# EAGLE design 55percent (EAGLE 9.5.2)
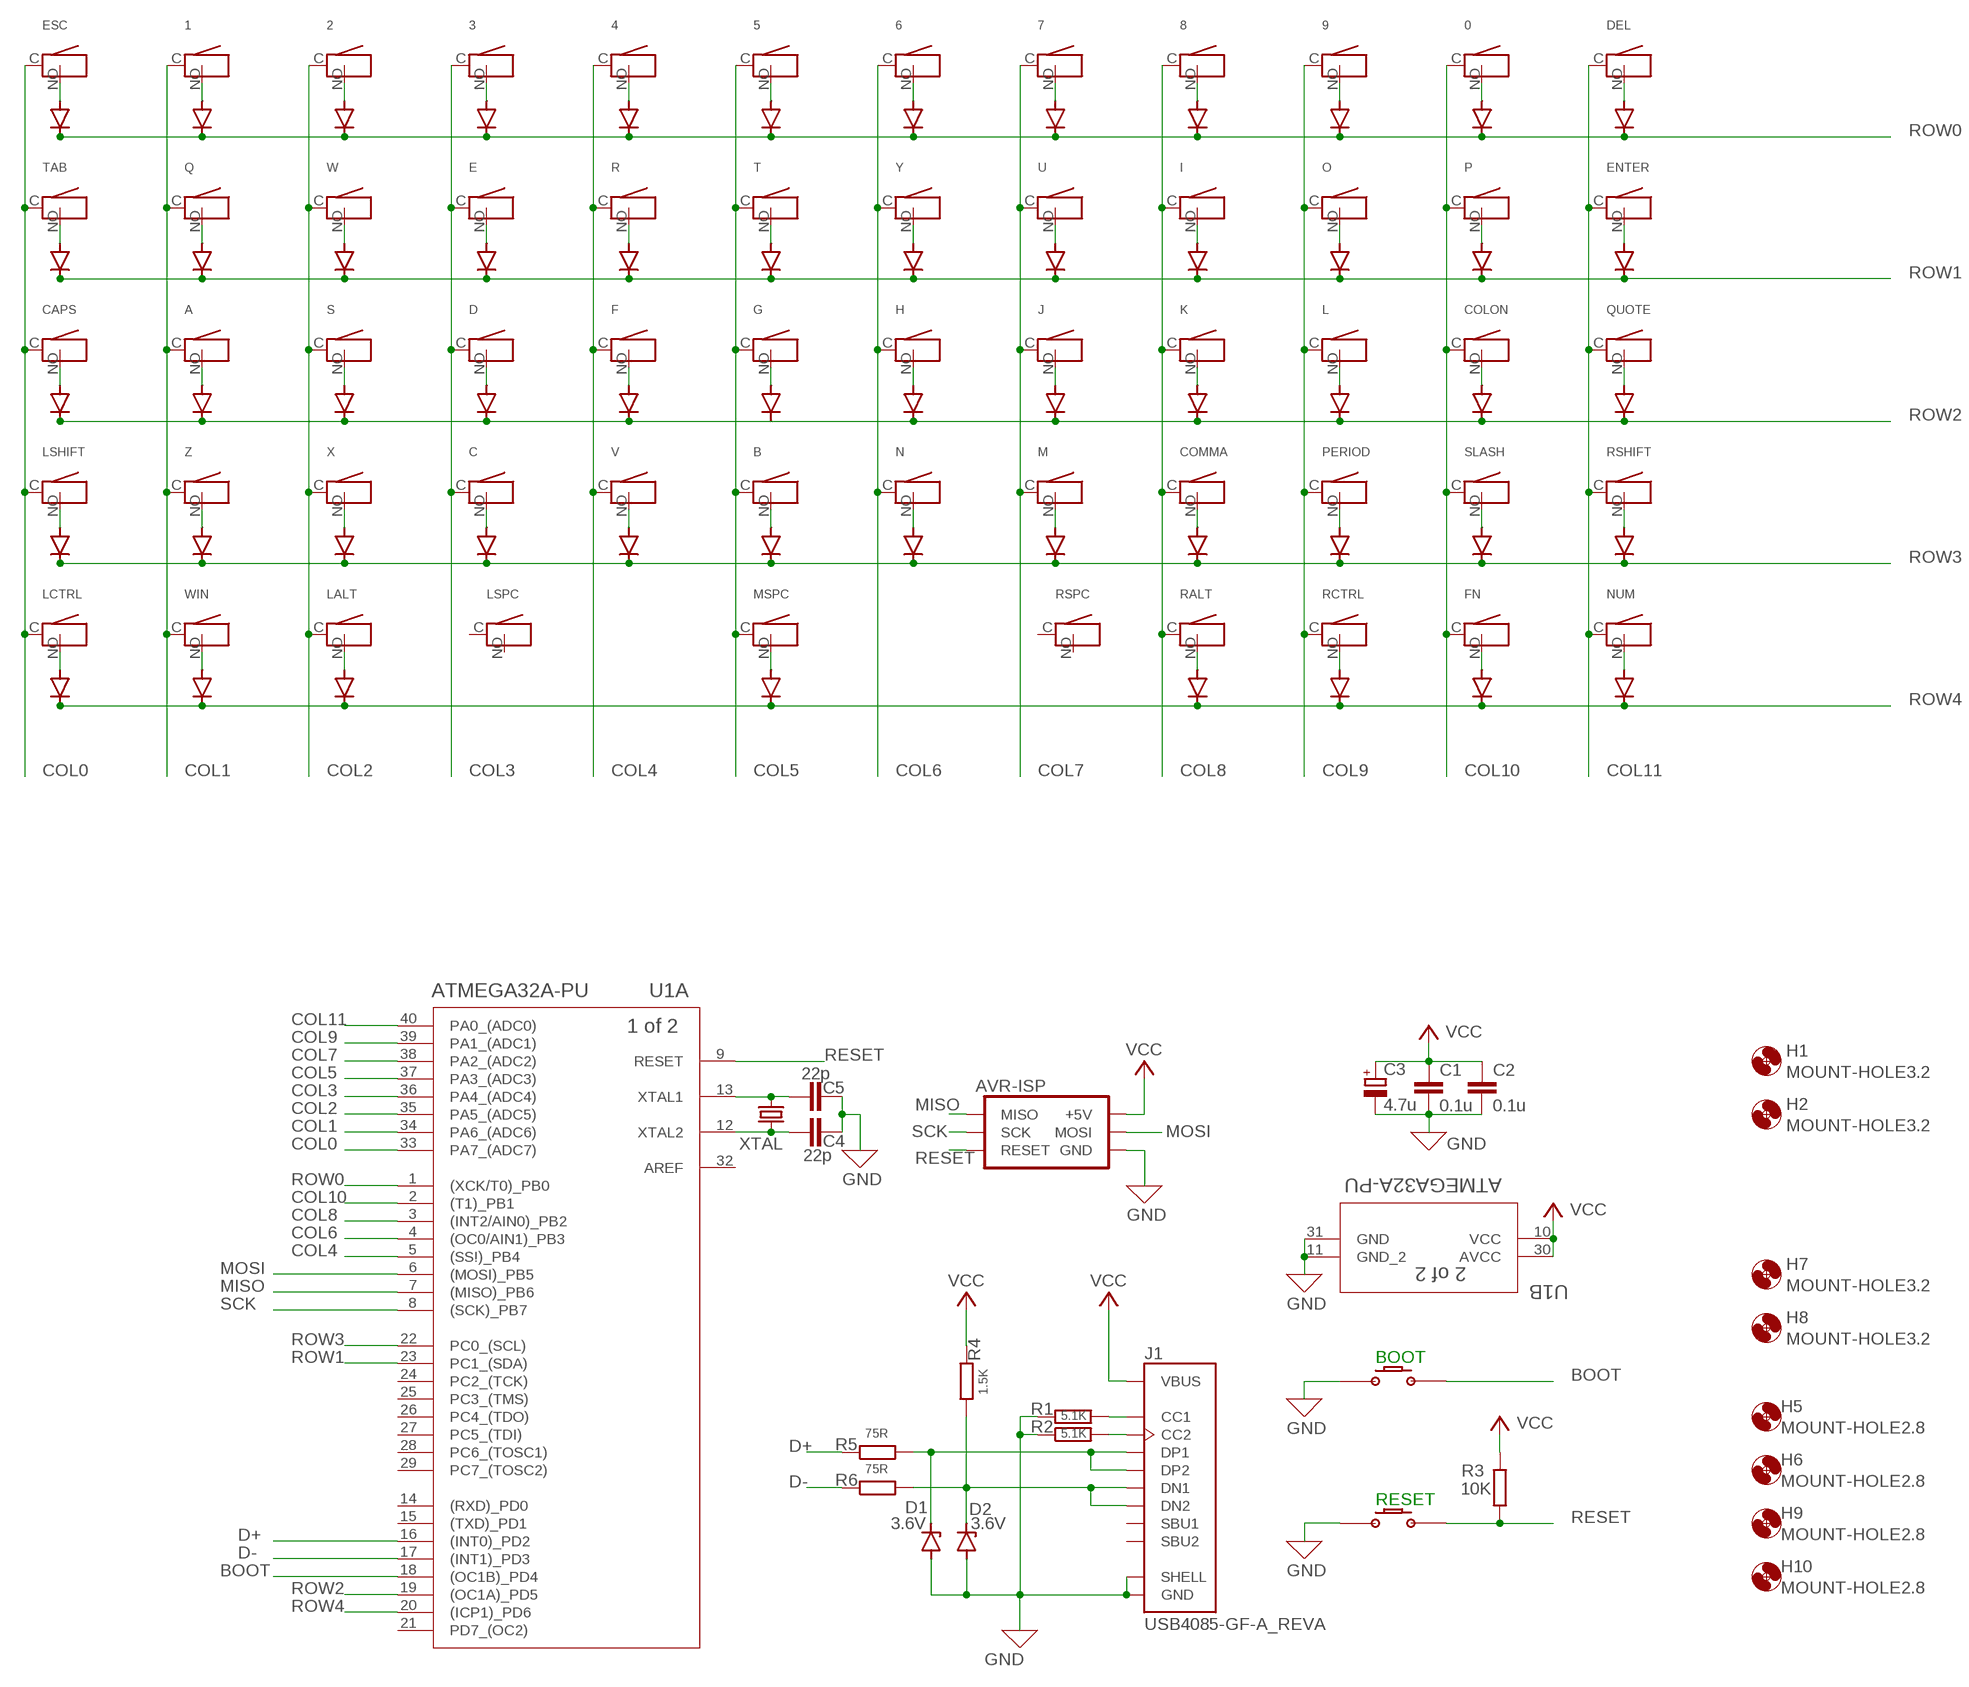
[diagram p0: schematic, sheet 1]

## Parts
0  D2F_MICROSWITCH  [D2F_MICROSWITCH]
1  D2F_MICROSWITCH  [D2F_MICROSWITCH]
2  D2F_MICROSWITCH  [D2F_MICROSWITCH]
3  D2F_MICROSWITCH  [D2F_MICROSWITCH]
4  D2F_MICROSWITCH  [D2F_MICROSWITCH]
5  D2F_MICROSWITCH  [D2F_MICROSWITCH]
6  D2F_MICROSWITCH  [D2F_MICROSWITCH]
7  D2F_MICROSWITCH  [D2F_MICROSWITCH]
8  D2F_MICROSWITCH  [D2F_MICROSWITCH]
9  D2F_MICROSWITCH  [D2F_MICROSWITCH]
A  D2F_MICROSWITCH  [D2F_MICROSWITCH]
B  D2F_MICROSWITCH  [D2F_MICROSWITCH]
C  D2F_MICROSWITCH  [D2F_MICROSWITCH]
C1  0.1u  C-EU025-024X044  [C025-024X044]
C2  0.1u  C-EU025-024X044  [C025-024X044]
C3  4.7u  CPOL-EUE2.5-5  [E2,5-5]
C4  22p  C-EU025-024X044  [C025-024X044]
C5  22p  C-EU025-024X044  [C025-024X044]
CAPS  D2F_MICROSWITCH  [D2F_MICROSWITCH]
COLON  D2F_MICROSWITCH  [D2F_MICROSWITCH]
COMMA  D2F_MICROSWITCH  [D2F_MICROSWITCH]
D  D2F_MICROSWITCH  [D2F_MICROSWITCH]
D1  3.6V  BZV10  [DO34Z7]
D2  3.6V  BZV10  [DO34Z7]
D3  1N4004  [DO41-10]
D4  1N4004  [DO41-10]
D5  1N4004  [DO41-10]
D6  1N4004  [DO41-10]
D7  1N4004  [DO41-10]
D8  1N4004  [DO41-10]
D9  1N4004  [DO41-10]
D10  1N4004  [DO41-10]
D11  1N4004  [DO41-10]
D12  1N4004  [DO41-10]
D13  1N4004  [DO41-10]
D14  1N4004  [DO41-10]
D15  1N4004  [DO41-10]
D16  1N4004  [DO41-10]
D17  1N4004  [DO41-10]
D18  1N4004  [DO41-10]
D19  1N4004  [DO41-10]
D20  1N4004  [DO41-10]
D21  1N4004  [DO41-10]
D23  1N4004  [DO41-10]
D24  1N4004  [DO41-10]
D25  1N4004  [DO41-10]
D26  1N4004  [DO41-10]
D28  1N4004  [DO41-10]
D29  1N4004  [DO41-10]
D30  1N4004  [DO41-10]
D31  1N4004  [DO41-10]
D32  1N4004  [DO41-10]
D33  1N4004  [DO41-10]
D34  1N4004  [DO41-10]
D35  1N4004  [DO41-10]
D36  1N4004  [DO41-10]
D38  1N4004  [DO41-10]
D39  1N4004  [DO41-10]
D40  1N4004  [DO41-10]
D41  1N4004  [DO41-10]
D43  1N4004  [DO41-10]
D44  1N4004  [DO41-10]
D45  1N4004  [DO41-10]
D46  1N4004  [DO41-10]
D47  1N4004  [DO41-10]
D48  1N4004  [DO41-10]
D49  1N4004  [DO41-10]
D50  1N4004  [DO41-10]
D51  1N4004  [DO41-10]
D52  1N4004  [DO41-10]
D53  1N4004  [DO41-10]
D54  1N4004  [DO41-10]
D55  1N4004  [DO41-10]
D56  1N4004  [DO41-10]
D57  1N4004  [DO41-10]
D58  1N4004  [DO41-10]
D59  1N4004  [DO41-10]
D60  1N4004  [DO41-10]
D61  1N4004  [DO41-10]
D62  1N4004  [DO41-10]
DEL  D2F_MICROSWITCH  [D2F_MICROSWITCH]
E  D2F_MICROSWITCH  [D2F_MICROSWITCH]
ENTER  D2F_MICROSWITCH  [D2F_MICROSWITCH]
ESC  D2F_MICROSWITCH  [D2F_MICROSWITCH]
F  D2F_MICROSWITCH  [D2F_MICROSWITCH]
FN  D2F_MICROSWITCH  [D2F_MICROSWITCH]
G  D2F_MICROSWITCH  [D2F_MICROSWITCH]
H  D2F_MICROSWITCH  [D2F_MICROSWITCH]
H1  MOUNT-HOLE3.2  [3,2]
H2  MOUNT-HOLE3.2  [3,2]
H5  MOUNT-HOLE2.8  [2,2]
H6  MOUNT-HOLE2.8  [2,2]
H7  MOUNT-HOLE3.2  [3,2]
H8  MOUNT-HOLE3.2  [3,2]
H9  MOUNT-HOLE2.8  [2,2]
H10  MOUNT-HOLE2.8  [2,2]
I  D2F_MICROSWITCH  [D2F_MICROSWITCH]
J  D2F_MICROSWITCH  [D2F_MICROSWITCH]
J1  USB4085-GF-A_REVA  [GCT_USB4085-GF-A_REVA]
JP1  PINHD-2X3  [2X03]
K  D2F_MICROSWITCH  [D2F_MICROSWITCH]
L  D2F_MICROSWITCH  [D2F_MICROSWITCH]
LALT  D2F_MICROSWITCH  [D2F_MICROSWITCH]
LCTRL  D2F_MICROSWITCH  [D2F_MICROSWITCH]
LSHIFT  D2F_MICROSWITCH  [D2F_MICROSWITCH]
LSPC  D2F_MICROSWITCH  [D2F_MICROSWITCH]
M  D2F_MICROSWITCH  [D2F_MICROSWITCH]
MSPC  D2F_MICROSWITCH  [D2F_MICROSWITCH]
N  D2F_MICROSWITCH  [D2F_MICROSWITCH]
NUM  D2F_MICROSWITCH  [D2F_MICROSWITCH]
O  D2F_MICROSWITCH  [D2F_MICROSWITCH]
P  D2F_MICROSWITCH  [D2F_MICROSWITCH]
PERIOD  D2F_MICROSWITCH  [D2F_MICROSWITCH]
Q  D2F_MICROSWITCH  [D2F_MICROSWITCH]
QUOTE  D2F_MICROSWITCH  [D2F_MICROSWITCH]
R  D2F_MICROSWITCH  [D2F_MICROSWITCH]
R1  5.1K  R-EU_0207/10  [0207/10]
R2  5.1K  R-EU_0207/10  [0207/10]
R3  10K  R-EU_0207/10  [0207/10]
R4  1.5K  R-EU_0207/10  [0207/10]
R5  75R  R-EU_0207/10  [0207/10]
R6  75R  R-EU_0207/10  [0207/10]
RALT  D2F_MICROSWITCH  [D2F_MICROSWITCH]
RCTRL  D2F_MICROSWITCH  [D2F_MICROSWITCH]
RSHIFT  D2F_MICROSWITCH  [D2F_MICROSWITCH]
RSPC  D2F_MICROSWITCH  [D2F_MICROSWITCH]
S  D2F_MICROSWITCH  [D2F_MICROSWITCH]
SLASH  D2F_MICROSWITCH  [D2F_MICROSWITCH]
T  D2F_MICROSWITCH  [D2F_MICROSWITCH]
TAB  D2F_MICROSWITCH  [D2F_MICROSWITCH]
U  D2F_MICROSWITCH  [D2F_MICROSWITCH]
U1  ATMEGA32A-PU  [40P6]
U$1  PTS636SK43LFS  [PTS636SK43LFSTHT]
U$2  PTS636SK43LFS  [PTS636SK43LFSTHT]
V  D2F_MICROSWITCH  [D2F_MICROSWITCH]
W  D2F_MICROSWITCH  [D2F_MICROSWITCH]
WIN  D2F_MICROSWITCH  [D2F_MICROSWITCH]
X  D2F_MICROSWITCH  [D2F_MICROSWITCH]
XTAL  CRYSTALHC49S  [HC49/S]
Y  D2F_MICROSWITCH  [D2F_MICROSWITCH]
Z  D2F_MICROSWITCH  [D2F_MICROSWITCH]

## Nets
BOOT: U1.18(A:(OC1B)_PD4) U$1.P$2
COL0: CAPS.C ESC.C LCTRL.C LSHIFT.C TAB.C U1.33(A:PA7_(ADC7))
COL1: 1.C A.C Q.C U1.34(A:PA6_(ADC6)) WIN.C Z.C
COL2: 2.C LALT.C S.C U1.35(A:PA5_(ADC5)) W.C X.C
COL3: 3.C C.C D.C E.C U1.36(A:PA4_(ADC4))
COL4: 4.C F.C R.C U1.5(A:(SS!)_PB4) V.C
COL5: 5.C B.C G.C MSPC.C T.C U1.37(A:PA3_(ADC3))
COL6: 6.C H.C N.C U1.4(A:(OC0/AIN1)_PB3) Y.C
COL7: 7.C J.C M.C U1.38(A:PA2_(ADC2)) U.C
COL8: 8.C COMMA.C I.C K.C RALT.C U1.3(A:(INT2/AIN0)_PB2)
COL9: 9.C L.C O.C PERIOD.C RCTRL.C U1.39(A:PA1_(ADC1))
COL10: 0.C COLON.C FN.C P.C SLASH.C U1.2(A:(T1)_PB1)
COL11: DEL.C ENTER.C NUM.C QUOTE.C RSHIFT.C U1.40(A:PA0_(ADC0))
D+: R5.1 U1.16(A:(INT0)_PD2)
D-: R6.1 U1.17(A:(INT1)_PD3)
GND: C1.2 C2.2 C3.- C4.1 C5.1 D1.A D2.A J1.A1(GND) J1.A12(GND) J1.B1(GND) J1.B12(GND) J1.P1(SHELL) J1.P2(SHELL) J1.P3(SHELL) J1.P4(SHELL) JP1.GND R1.1 R2.1 U1.11(B:GND_2) U1.31(B:GND) U$1.P$1 U$2.P$1
MISO: JP1.MISO U1.7(A:(MISO)_PB6)
MOSI: JP1.MOSI U1.6(A:(MOSI)_PB5)
N$1: J1.A5(CC1) R1.2
N$2: J1.B5(CC2) R2.2
N$3: D1.C J1.A6(DP1) J1.B6(DP2) R5.2
N$4: D7.A LCTRL.NO(O)
N$5: C5.2 U1.13(A:XTAL1) XTAL.1
N$6: C4.2 U1.12(A:XTAL2) XTAL.2
N$7: D2.C J1.A7(DN1) J1.B7(DN2) R4.2 R6.2
N$8: D6.A LSHIFT.NO(O)
N$9: CAPS.NO(O) D5.A
N$10: D4.A TAB.NO(O)
N$11: D3.A ESC.NO(O)
N$17: D12.A WIN.NO(O)
N$18: D11.A Z.NO(O)
N$19: A.NO(O) D10.A
N$20: D9.A Q.NO(O)
N$21: 1.NO(O) D8.A
N$27: D17.A LALT.NO(O)
N$28: D16.A X.NO(O)
N$29: D15.A S.NO(O)
N$30: D14.A W.NO(O)
N$31: 2.NO(O) D13.A
N$38: C.NO(O) D21.A
N$39: D20.A D.NO(O)
N$40: D19.A E.NO(O)
N$41: 3.NO(O) D18.A
N$48: D26.A V.NO(O)
N$49: D25.A F.NO(O)
N$50: D24.A R.NO(O)
N$51: 4.NO(O) D23.A
N$57: D32.A MSPC.NO(O)
N$58: B.NO(O) D31.A
N$59: D30.A G.NO(O)
N$60: D29.A T.NO(O)
N$61: 5.NO(O) D28.A
N$68: D36.A N.NO(O)
N$69: D35.A H.NO(O)
N$70: D34.A Y.NO(O)
N$71: 6.NO(O) D33.A
N$78: D41.A M.NO(O)
N$79: D40.A J.NO(O)
N$80: D39.A U.NO(O)
N$81: 7.NO(O) D38.A
N$87: D47.A RALT.NO(O)
N$88: COMMA.NO(O) D46.A
N$89: D45.A K.NO(O)
N$90: D44.A I.NO(O)
N$91: 8.NO(O) D43.A
N$97: D52.A RCTRL.NO(O)
N$98: D51.A PERIOD.NO(O)
N$99: D50.A L.NO(O)
N$100: D49.A O.NO(O)
N$101: 9.NO(O) D48.A
N$107: D57.A FN.NO(O)
N$108: D56.A SLASH.NO(O)
N$109: COLON.NO(O) D55.A
N$110: D54.A P.NO(O)
N$111: 0.NO(O) D53.A
N$117: D62.A NUM.NO(O)
N$118: D61.A RSHIFT.NO(O)
N$119: D60.A QUOTE.NO(O)
N$120: D59.A ENTER.NO(O)
N$121: D58.A DEL.NO(O)
RESET: JP1.RESET R3.1 U1.9(A:RESET) U$2.P$2
ROW0: D3.C D8.C D13.C D18.C D23.C D28.C D33.C D38.C D43.C D48.C D53.C D58.C U1.1(A:(XCK/T0)_PB0)
ROW1: D4.C D9.C D14.C D19.C D24.C D29.C D34.C D39.C D44.C D49.C D54.C D59.C U1.23(A:PC1_(SDA))
ROW2: D5.C D10.C D15.C D20.C D25.C D30.C D35.C D40.C D45.C D50.C D55.C D60.C U1.19(A:(OC1A)_PD5)
ROW3: D6.C D11.C D16.C D21.C D26.C D31.C D36.C D41.C D46.C D51.C D56.C D61.C U1.22(A:PC0_(SCL))
ROW4: D7.C D12.C D17.C D32.C D47.C D52.C D57.C D62.C U1.20(A:(ICP1)_PD6)
SCK: JP1.SCK U1.8(A:(SCK)_PB7)
VCC: C1.1 C2.1 C3.+ J1.A4(VBUS) J1.A9(VBUS) J1.B4(VBUS) J1.B9(VBUS) JP1.+5V R3.2 R4.1 U1.10(B:VCC) U1.30(B:AVCC)
Unconnected: 0.NC 1.NC 2.NC 3.NC 4.NC 5.NC 6.NC 7.NC 8.NC 9.NC A.NC B.NC C.NC CAPS.NC COLON.NC COMMA.NC D.NC DEL.NC E.NC ENTER.NC ESC.NC F.NC FN.NC G.NC H.NC I.NC J1.A8(SBU1) J1.B8(SBU2) J.NC K.NC L.NC LALT.NC LCTRL.NC LSHIFT.NC LSPC.C LSPC.NC LSPC.NO(O) M.NC MSPC.NC N.NC NUM.NC O.NC P.NC PERIOD.NC Q.NC QUOTE.NC R.NC RALT.NC RCTRL.NC RSHIFT.NC RSPC.C RSPC.NC RSPC.NO(O) S.NC SLASH.NC T.NC TAB.NC U1.14(A:(RXD)_PD0) U1.15(A:(TXD)_PD1) U1.21(A:PD7_(OC2)) U1.24(A:PC2_(TCK)) U1.25(A:PC3_(TMS)) U1.26(A:PC4_(TDO)) U1.27(A:PC5_(TDI)) U1.28(A:PC6_(TOSC1)) U1.29(A:PC7_(TOSC2)) U1.32(A:AREF) U.NC V.NC W.NC WIN.NC X.NC Y.NC Z.NC

## Notes on the sheet
- BOOT
- RESET

## Library data of the parts
0 1-9 A B C CAPS COLON COMMA D DEL E ENTER ESC F FN G H I J K L LALT LCTRL LSHIFT LSPC M MSPC N NUM O P PERIOD Q QUOTE R RALT RCTRL RSHIFT RSPC S SLASH T TAB U V W WIN X Y Z = 59percent:D2F_MICROSWITCH: D2F Microswitch
C1 C2 C4 C5 = rcl:C-EU: CAPACITOR, European symbol; SPICEPREFIX: C
C3 = rcl:CPOL-EU: POLARIZED CAPACITOR, European symbol; SPICEPREFIX: C
D1 D2 = diode:BZV10: Z DIODE
D3-D21 D23-D26 D28-D36 D38-D41 D43-D62 = 59percent:1N4004: DIODE general purpose rectifier, 1 A
H1 H2 H5-H10 = 59percent:MOUNT-HOLE: MOUNTING HOLE with drill center marker
J1 = 59percent:USB4085-GF-A_REVA: USB 2.0 Type C Receptacle Dip Type, PCB Top Mount; AVAILABILITY: Unavailable; DESCRIPTION: USB-C _USB TYPE-C_ USB 2.0 Receptacle Connector 24 _16+8 Dummy_ Position Through Hole, Right Angle; MF: Global Connector Technology; MP: USB4085-GF-A; PACKAGE: Package Analog Devices; PRICE: None
JP1 = 59percent:PINHD-2X3: PIN HEADER
R1-R6 = rcl:R-EU_: RESISTOR, European symbol; SPICEPREFIX: R
U1 = 59percent:ATMEGA32A-PU; BUILT_BY: EMA_UL_Team; MANUFACTURER_PART_NUMBER: ATMEGA32A-PU; VENDOR: Atmel
U$1 U$2 = 59percent:PTS636SK43LFS
XTAL = crystal:CRYSTAL: CRYSTAL; OC_FARNELL: 1667008; OC_NEWARK: unknown

## Board
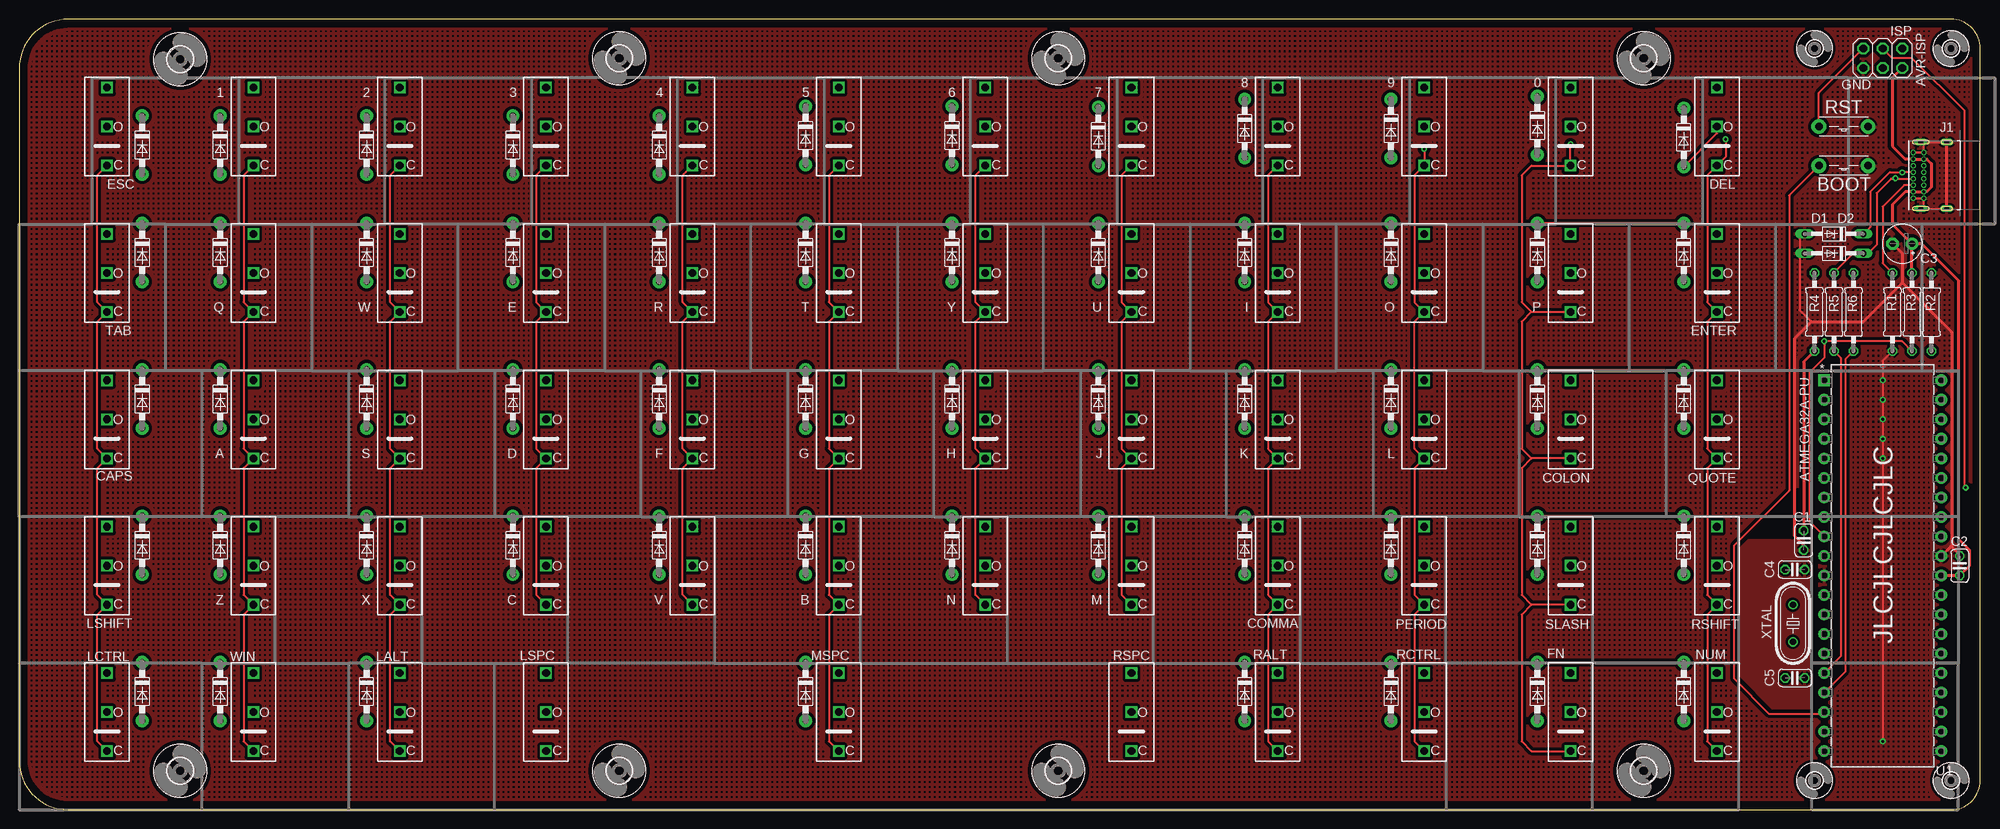
[diagram p1: board, top side]
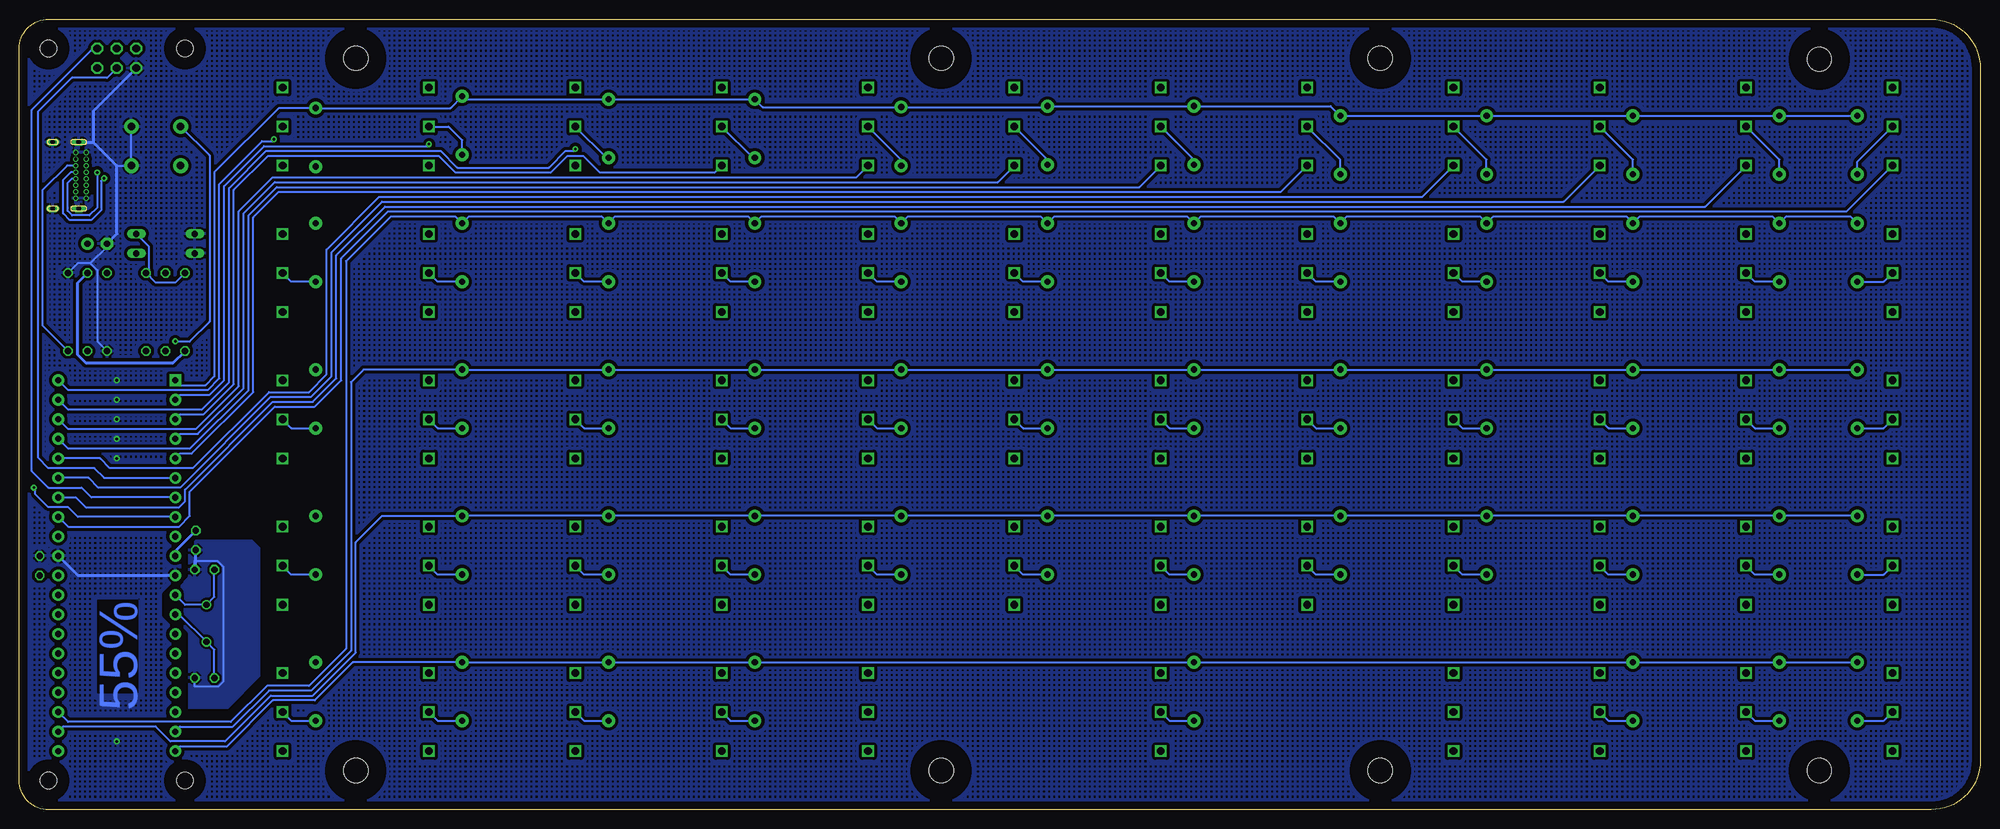
[diagram p2: board, bottom side, seen from below]

Size 255.27 x 102.87 mm. Coordinates in mm from the lower left corner, seen from the top.
Outline: 6.35,0 251.46,0 arc90 255.27,3.81 255.27,99.06 arc90 251.46,102.87 6.35,102.87 arc90 0,96.52 0,6.35 arc90 6.35,0
Copper layers (1*16): Top 0.035mm / dielectric 1.5mm / Bottom 0.035mm
Design rules "default *": minimum track width 6mil, minimum drill 0.35mm, track to track 6mil, track to pad 6mil, pad to pad 6mil, via to via 6mil, smd to smd 6mil, copper to edge 40mil, drill to drill 6mil, minimum pad ring 5mil, minimum via ring 8mil, stop-mask expansion 4mil, vias tented up to drill 0mil, thermal gap 10mil
tRestrict: 12 lines
bRestrict: 11 lines

### Footprints (pad centres in the part's own frame; a part is rotated, then mirrored left to right if it is on the bottom)
D2F_MICROSWITCH = drill 1 square: C -5.08,0; NC 5.08,0; NO 0,0
C025-024X044 = drill 0.813 octagon: 1 -1.27,0; 2 1.27,0
E2,5-5 = drill 0.813 pad 1.6: + -1.27,0 | drill 0.813 pad 1.6 octagon: - 1.27,0
DO34Z7 = drill 0.813 long: A 3.81,0; C -3.81,0
DO41-10 = drill 0.8 pad 1.676: A 3.81,0; C -3.81,0
3,2 = hole 3.2: 0,0
2,2 = hole 2.2: 0,0
GCT_USB4085-GF-A_REVA = drill 0.4 pad 0.65: A1 -2.975,4.025; A4 -2.125,4.025; A5 -1.275,4.025; A6 -0.425,4.025; A7 0.425,4.025; A8 1.275,4.025; A9 2.125,4.025; A12 2.975,4.025; B1 2.975,2.675; B4 2.125,2.675; B5 1.275,2.675; B6 0.425,2.675; B7 -0.425,2.675; B8 -1.275,2.675; B9 -2.125,2.675; B12 -2.975,2.675 | drill 0.6 long: P1 -4.325,3.045; P2 4.325,3.045; P3 4.325,-0.335; P4 -4.325,-0.335
2X03 = drill 1.016 octagon: +5V -2.54,1.27; GND 2.54,1.27; MISO -2.54,-1.27; MOSI 0,1.27; RESET 2.54,-1.27; SCK 0,-1.27
0207/10 = drill 0.813 octagon: 1 -5.08,0; 2 5.08,0
40P6 = drill 0.813 pad 1.524 square: 1 -15.24,48.26 | drill 0.813 pad 1.524: 2 -15.24,45.72; 3 -15.24,43.18; 4 -15.24,40.64; 5 -15.24,38.1; 6 -15.24,35.56; 7 -15.24,33.02; 8 -15.24,30.48; 9 -15.24,27.94; 10 -15.24,25.4; 11 -15.24,22.86; 12 -15.24,20.32; 13 -15.24,17.78; 14 -15.24,15.24; 15 -15.24,12.7; 16 -15.24,10.16; 17 -15.24,7.62; 18 -15.24,5.08; 19 -15.24,2.54; 20 -15.24,0; 21 0,0; 22 0,2.54; 23 0,5.08; 24 0,7.62; 25 0,10.16; 26 0,12.7; 27 0,15.24; 28 0,17.78; 29 0,20.32; 30 0,22.86; 31 0,25.4; 32 0,27.94; 33 0,30.48; 34 0,33.02; 35 0,35.56; 36 0,38.1; 37 0,40.64; 38 0,43.18; 39 0,45.72; 40 0,48.26
PTS636SK43LFSTHT = drill 1 pad 1.93: P$1 -3.175,0; P$2 3.225,0
HC49/S = drill 0.813: 1 -2.413,0; 2 2.413,0

### Placement (x,y rotation side)
0  201.93,88.9 90 top
1  30.48,88.9 90 top
2  49.53,88.9 90 top
3  68.58,88.9 90 top
4  87.63,88.9 90 top
5  106.68,88.9 90 top
6  125.73,88.9 90 top
7  144.78,88.9 90 top
8  163.83,88.9 90 top
9  182.88,88.9 90 top
A  30.48,50.8 90 top
B  106.68,31.75 90 top
C  68.58,31.75 90 top
C1  232.28,35.05 270 top
C2  252.6,31.75 90 top
C3  245.11,73.66 180 top
C4  231.14,31.24 180 top
C5  231.14,17.14 180 top
CAPS  11.43,50.8 90 top
COLON  201.93,50.8 90 top
COMMA  163.83,31.75 90 top
D  68.58,50.8 90 top
D1  236.22,72.39 180 top
D2  236.22,74.93 180 top
D3  16,86.49 270 top
D4  16,72.52 270 top
D5  16,53.47 270 top
D6  16,34.42 270 top
D7  16,15.37 270 top
D8  26.16,86.49 270 top
D9  26.16,72.52 270 top
D10  26.16,53.47 270 top
D11  26.16,34.42 270 top
D12  26.16,15.37 270 top
D13  45.21,86.49 270 top
D14  45.21,72.52 270 top
D15  45.21,53.47 270 top
D16  45.21,34.42 270 top
D17  45.21,15.37 270 top
D18  64.26,86.49 270 top
D19  64.26,72.52 270 top
D20  64.26,53.47 270 top
D21  64.26,34.42 270 top
D23  83.31,86.49 270 top
D24  83.31,72.52 270 top
D25  83.31,53.47 270 top
D26  83.31,34.42 270 top
D28  102.36,87.76 270 top
D29  102.36,72.52 270 top
D30  102.36,53.47 270 top
D31  102.36,34.42 270 top
D32  102.36,15.37 270 top
D33  121.41,87.76 270 top
D34  121.41,72.52 270 top
D35  121.41,53.47 270 top
D36  121.41,34.42 270 top
D38  140.46,87.63 270 top
D39  140.46,72.52 270 top
D40  140.46,53.47 270 top
D41  140.46,34.42 270 top
D43  159.51,88.65 270 top
D44  159.51,72.52 270 top
D45  159.51,53.47 270 top
D46  159.51,34.42 270 top
D47  159.51,15.37 270 top
D48  178.56,88.65 270 top
D49  178.56,72.52 270 top
D50  178.56,53.47 270 top
D51  178.56,34.42 270 top
D52  178.56,15.37 270 top
D53  197.61,89.03 270 top
D54  197.61,72.52 270 top
D55  197.61,53.47 270 top
D56  197.61,34.42 270 top
D57  197.61,15.37 270 top
D58  216.66,87.5 270 top
D59  216.66,72.52 270 top
D60  216.66,53.47 270 top
D61  216.66,34.42 270 top
D62  216.66,15.37 270 top
DEL  220.98,88.9 90 top
E  68.58,69.85 90 top
ENTER  220.98,69.85 90 top
ESC  11.43,88.9 90 top
F  87.63,50.8 90 top
FN  201.93,12.7 90 top
G  106.68,50.8 90 top
H  125.73,50.8 90 top
H1  20.95,5.08 0 top
H2  20.95,97.66 0 top
H3  MOUNT-HOLE3.2  [3,2]  135.25,5.08 0 top
H4  MOUNT-HOLE3.2  [3,2]  78.11,97.79 0 top
H5  251.46,99.06 0 top
H6  233.68,99.06 0 top
H7  211.46,97.79 0 top
H8  211.46,5.08 0 top
H9  233.68,3.81 0 top
H10  251.46,3.81 0 top
H11  MOUNT-HOLE3.2  [3,2]  78.11,5.08 0 top
H12  MOUNT-HOLE3.2  [3,2]  135.25,97.79 0 top
I  163.83,69.85 90 top
J  144.78,50.8 90 top
J1  250.57,82.55 90 top
JP1  242.57,97.79 180 top
K  163.83,50.8 90 top
L  182.88,50.8 90 top
LALT  49.53,12.7 90 top
LCTRL  11.43,12.7 90 top
LSHIFT  11.43,31.75 90 top
LSPC  68.58,12.7 90 top
M  144.78,31.75 90 top
MSPC  106.68,12.7 90 top
N  125.73,31.75 90 top
NUM  220.98,12.7 90 top
O  182.88,69.85 90 top
P  201.93,69.85 90 top
PERIOD  182.88,31.75 90 top
Q  30.48,69.85 90 top
QUOTE  220.98,50.8 90 top
R  87.63,69.85 90 top
R1  243.84,64.77 90 top
R2  248.92,64.77 270 top
R3  246.38,64.77 90 top
R4  233.68,64.77 90 top
R5  236.22,64.77 90 top
R6  238.76,64.77 90 top
RALT  163.83,12.7 90 top
RCTRL  182.88,12.7 90 top
RSHIFT  220.98,31.75 90 top
RSPC  144.78,12.7 90 top
S  49.53,50.8 90 top
SLASH  201.93,31.75 90 top
T  106.68,69.85 90 top
TAB  11.43,69.85 90 top
U  144.78,69.85 90 top
U1  250.19,7.62 0 top
U$1  237.49,83.82 180 top
U$2  237.49,88.9 180 top
V  87.63,31.75 90 top
W  49.53,69.85 90 top
WIN  30.48,12.7 90 top
X  49.53,31.75 90 top
XTAL  230.89,24.26 90 top
Y  125.73,69.85 90 top
Z  30.48,31.75 90 top

### Tracks (layer width: path | path; a pad name or v marks a point on that pad's centre or on a via)
BOOT
  Top 0.254: U1.18 234.82,12.7 234.57,12.45 227.84,12.45 223.27,17.02 223.27,34.42 230.38,41.53 230.38,79.93 U$1.P$2
COL0
  Top 0.254: LCTRL.C 10.16,8.89 10.16,25.4 LSHIFT.C 10.16,27.94 10.16,44.45 CAPS.C 10.16,46.99 10.16,63.5 TAB.C 10.16,66.04 10.16,82.55 ESC.C
  Bottom 0.254: U1.33 248.92,36.83 234.44,36.83 233.04,38.23 233.04,41.4 222,52.45 216.79,52.45 213.36,55.88 213.36,71.75 207.26,77.85 17.4,77.85 ESC.C
COL1
  Top 0.254: 1.C 29.21,82.55 29.21,66.04 Q.C 29.21,63.5 29.21,46.99 A.C 29.21,44.45 29.21,27.94 Z.C 29.21,25.4 29.21,8.89 WIN.C
  Bottom 0.254: U1.34 247.9,40.64 246.63,39.37 234.44,39.37 233.68,40.13 233.68,41.66 222.25,53.09 217.04,53.09 214,56.13 214,72.14 207.65,78.49 35.81,78.49 1.C
COL2
  Top 0.254: LALT.C 48.26,8.89 48.26,25.4 X.C 48.26,27.94 48.26,44.45 S.C 48.26,46.99 48.26,63.5 W.C 48.26,66.04 48.26,82.55 2.C
  Bottom 0.254: U1.35 246.25,43.18 244.98,41.91 234.31,41.91 222.5,53.72 217.3,53.72 214.63,56.39 214.63,72.52 208.03,79.12 54.23,79.12 2.C
COL3
  Top 0.254: 3.C 67.31,82.55 67.31,66.04 E.C 67.31,63.5 67.31,46.99 D.C 67.31,44.45 67.31,27.94 C.C
  Bottom 0.254: U1.36 244.73,45.72 243.46,44.45 232.66,44.45 222.76,54.36 217.55,54.36 215.26,56.64 215.26,72.9 208.41,79.76 72.64,79.76 3.C
COL4
  Top 0.254: V.C 86.36,27.94 86.36,44.45 F.C 86.36,46.99 86.36,63.5 R.C 86.36,66.04 86.36,82.55 4.C
  Bottom 0.254: U1.5 234.31,46.35 232.79,46.35 224.79,54.36 224.79,77.09 221.49,80.39 91.06,80.39 4.C
COL5
  Top 0.254: 5.C 105.41,82.55 105.41,66.04 T.C 105.41,63.5 105.41,46.99 G.C 105.41,44.45 105.41,27.94 B.C 105.41,25.4 105.41,8.89 MSPC.C
  Bottom 0.254: U1.37 248.92,46.99 233.04,46.99 225.43,54.61 225.43,77.34 221.74,81.03 109.47,81.03 5.C
COL6
  Top 0.254: N.C 124.46,27.94 124.46,44.45 H.C 124.46,46.99 124.46,63.5 Y.C 124.46,66.04 124.46,82.55 6.C
  Bottom 0.254: U1.4 234.31,48.9 232.03,48.9 226.06,54.86 226.06,77.6 222,81.66 127.89,81.66 6.C
COL7
  Top 0.254: 7.C 143.51,82.55 143.51,66.04 U.C 143.51,63.5 143.51,46.99 J.C 143.51,44.45 143.51,27.94 M.C
  Bottom 0.254: U1.38 248.92,49.53 232.28,49.53 226.69,55.12 226.69,77.85 222.25,82.3 146.3,82.3 7.C
COL8
  Top 0.254: 8.C 162.56,82.55 162.56,66.04 I.C 162.56,63.5 162.56,46.99 K.C 162.56,44.45 162.56,27.94 COMMA.C 162.56,25.4 162.56,8.89 RALT.C
  Bottom 0.254: U1.3 234.31,51.44 231.27,51.44 227.33,55.37 227.33,80.64 222.88,85.09 200.66,85.09 198.5,82.93 186.06,82.93 183.9,85.09 181.86,85.09 179.71,82.93 164.72,82.93 8.C
COL9  (via drill 0.35)
  Top 0.254: v182.88,85.98 9.C 181.61,82.55 181.61,66.04 O.C 181.61,63.5 181.61,46.99 L.C 181.61,44.45 181.61,27.94 PERIOD.C 181.61,25.4 181.61,8.89 RCTRL.C
  Bottom 0.254: U1.39 248.92,52.07 231.52,52.07 227.97,55.63 227.97,80.9 223.14,85.72 200.41,85.72 198.25,83.57 186.31,83.57 184.15,85.72 182.88,85.72 v182.88,85.98
COL10  (via drill 0.35)
  Top 0.254: 196.85,64.77 195.58,66.04 195.58,82.55 196.85,83.82 0.C v201.93,86.61 | 196.85,64.77 P.C | 196.85,64.77 195.58,63.5 195.58,46.99 196.85,45.72 | COLON.C 196.85,45.72 | 196.85,45.72 195.58,44.45 195.58,27.94 196.85,26.67 | SLASH.C 196.85,26.67 | 196.85,26.67 195.58,25.4 195.58,8.89 196.85,7.62 FN.C
  Bottom 0.254: U1.2 234.31,53.98 230.5,53.98 228.6,55.88 228.6,81.15 223.39,86.36 201.93,86.36 v201.93,86.61
COL11  (via drill 0.35)
  Top 0.254: v222.12,87.25 222.12,84.96 DEL.C 219.71,82.55 219.71,66.04 ENTER.C 219.71,63.5 219.71,46.99 QUOTE.C 219.71,44.45 219.71,27.94 RSHIFT.C 219.71,25.4 219.71,8.89 NUM.C
  Bottom 0.254: U1.40 248.92,54.61 230.76,54.61 229.24,56.13 229.24,81.41 223.65,87 222.12,87 v222.12,87.25
D+
  Top 0.254: R5.1 237.11,58.8 237.11,19.94 U1.16
D-
  Top 0.254: U1.17 237.74,18.03 237.74,58.67 R6.1
GND  (via drill 0.35)
  Top 0.254: J1.A12 J1.B1 247.9,86.5 J1.P2 | J1.P4 J1.P1 247.9,78.59 J1.B12 J1.A1 | D2.A 231.78,74.3 231.78,73.03 D1.A 231.78,71.75 231.78,65.02 233.3,63.5 | R1.1 242.57,58.42 v242.57,55.88 v242.57,53.34 v242.57,50.8 v242.57,48.26 v242.57,45.72 v242.57,8.89
  Top 0.406: C1.2 232.28,34.42 231.14,35.56 231.14,61.34 233.3,63.5 240.03,63.5 245.11,68.58 | 245.11,68.58 245.11,72.39 C3.- | J1.P4 J1.P3 J1.P2 | 245.11,68.58 251.59,62.1 251.59,34.16 | 251.59,34.16 252.6,33.15 C2.2 | 251.59,34.16 251.46,34.29 U1.31
  Bottom 0.254: C5.1 232.41,16 229.36,16 228.73,16.64 228.73,31.62 229.49,32.38 232.41,32.38 C4.1 | 246,71.12 243.84,73.28 C3.- | 246,71.12 247.65,71.12 R2.1 | 246,71.12 245.11,70.23 245.11,60.96 R1.1 | 242.57,83.82 U$1.P$1 U$2.P$1
  Bottom 0.406: J1.P2 245.62,86.88 | 245.62,86.88 242.57,83.82 242.57,74.93 C3.- | U1.31 247.65,30.48 U1.11 | C4.1 232.28,31.37 C1.2 | 245.62,86.88 245.62,90.92 JP1.GND
  pour Bottom (isolate 0.305): 233.68,12.7 233.68,34.29 232.41,35.56 224.79,35.56 223.52,34.29 223.52,17.14 227.97,12.7
  pour Top (isolate 0.305): 224.79,35.56 232.41,35.56 233.68,34.29 233.68,12.7 227.97,12.7 223.52,17.14 223.52,34.29
  pour Bottom (isolate 0.152): 245.11,27.81 240.16,27.81 239.27,26.92 239.27,14.86 239.78,14.35 245.11,14.35 245.62,14.86 245.62,27.3
  pour Top (isolate 0.406, hatched): 6.35,101.6 252.73,101.6 254,100.33 254,3.81 251.46,1.27 6.35,1.27 arc-90 1.27,6.35 1.27,96.52 arc-90
  pour Bottom (isolate 0.406, hatched): 1.27,96.52 arc-90 6.35,101.6 252.73,101.6 254,100.33 254,3.81 251.46,1.27 6.35,1.27 arc-90 1.27,6.35
MISO
  Bottom 0.254: U1.7 245.87,40.64 247.14,41.91 251.46,41.91 253.62,44.07 253.62,91.06 245.62,99.06 JP1.MISO
MOSI
  Bottom 0.254: U1.6 244.22,43.18 245.49,44.45 251.46,44.45 252.86,45.85 252.86,90.81 248.41,95.25 243.84,95.25 JP1.MOSI
N$1
  Top 0.254: J1.A5 245.36,81.28 242.57,78.49 242.57,71.12 R1.2
N$2
  Bottom 0.254: J1.B5 249.05,83.83 252.22,80.65 252.22,62.99 R2.2
N$3  (via drill 0.35)
  Top 0.254: 244.18,82.12 243.67,82.12 241.78,80.24 241.78,73.51 240.66,72.39 D1.C 238.76,72.39 R5.2 | 244.18,82.12 J1.A6 | v244.22,82.17 244.18,82.12
  Bottom 0.254: v244.22,82.17 244.6,81.79 244.6,77.98 245.87,76.71 248.67,76.71 249.56,77.6 249.56,81.96 248.54,82.97 J1.B6
N$4
  Bottom 0.254: D7.A 12.57,11.56 LCTRL.NO
N$5
  Bottom 0.254: C5.2 229.87,20.83 XTAL.1 234.44,25.4 U1.13
N$6
  Bottom 0.254: U1.12 233.68,26.67 XTAL.2 229.87,27.69 C4.2
N$7  (via drill 0.35)
  Top 0.254: 245.11,82.97 243.5,82.97 240.92,80.39 240.92,75.82 D2.C | J1.A7 245.11,82.97 | v245.11,82.93 245.11,82.97
  Bottom 0.254: v245.11,82.93 245.11,78.36 246.13,77.34 248.38,77.34 248.96,77.92 248.96,81.58 248.41,82.12 J1.B7 | R4.2 234.95,68.58 237.49,68.58 R6.2 238.38,70.23 238.38,73.28 D2.C
N$8
  Bottom 0.254: D6.A 12.57,30.61 LSHIFT.NO
N$9
  Bottom 0.254: D5.A 12.57,49.66 CAPS.NO
N$10
  Bottom 0.254: D4.A 12.57,68.71 TAB.NO
N$11
  Bottom 0.254: D3.A 16,84.33 ESC.NO
N$17
  Bottom 0.254: WIN.NO 29.34,11.56 D12.A
N$18
  Bottom 0.254: D11.A 29.34,30.61 Z.NO
N$19
  Bottom 0.254: A.NO 29.34,49.66 D10.A
N$20
  Bottom 0.254: D9.A 29.34,68.71 Q.NO
N$21
  Bottom 0.254: D8.A 26.16,84.58 1.NO
N$27
  Bottom 0.254: LALT.NO 48.39,11.56 D17.A
N$28
  Bottom 0.254: D16.A 48.39,30.61 X.NO
N$29
  Bottom 0.254: S.NO 48.39,49.66 D15.A
N$30
  Bottom 0.254: D14.A 48.39,68.71 W.NO
N$31
  Bottom 0.254: D13.A 45.21,84.58 2.NO
N$38
  Bottom 0.254: D21.A 67.44,30.61 C.NO
N$39
  Bottom 0.254: D.NO 67.44,49.66 D20.A
N$40
  Bottom 0.254: D19.A 67.44,68.71 E.NO
N$41
  Bottom 0.254: D18.A 64.26,84.58 3.NO
N$48
  Bottom 0.254: D26.A 86.49,30.61 V.NO
N$49
  Bottom 0.254: F.NO 86.49,49.66 D25.A
N$50
  Bottom 0.254: D24.A 86.49,68.71 R.NO
N$51
  Bottom 0.254: D23.A 83.31,84.58 4.NO
N$57
  Bottom 0.254: MSPC.NO 105.54,11.56 D32.A
N$58
  Bottom 0.254: D31.A 105.54,30.61 B.NO
N$59
  Bottom 0.254: G.NO 105.54,49.66 D30.A
N$60
  Bottom 0.254: D29.A 105.54,68.71 T.NO
N$61
  Bottom 0.254: D28.A 102.36,84.58 5.NO
N$68
  Bottom 0.254: D36.A 124.59,30.61 N.NO
N$69
  Bottom 0.254: H.NO 124.59,49.66 D35.A
N$70
  Bottom 0.254: D34.A 124.59,68.71 Y.NO
N$71
  Bottom 0.254: 6.NO 121.41,84.58 D33.A
N$78
  Bottom 0.254: D41.A 143.64,30.61 M.NO
N$79
  Bottom 0.254: J.NO 143.64,49.66 D40.A
N$80
  Bottom 0.254: D39.A 143.64,68.71 U.NO
N$81
  Bottom 0.254: 7.NO 140.46,84.58 D38.A
N$87
  Bottom 0.254: RALT.NO 162.69,11.56 D47.A
N$88
  Bottom 0.254: D46.A 162.69,30.61 COMMA.NO
N$89
  Bottom 0.254: K.NO 162.69,49.66 D45.A
N$90
  Bottom 0.254: D44.A 162.69,68.71 I.NO
N$91
  Bottom 0.254: 8.NO 159.77,84.84 D43.A
N$97
  Bottom 0.254: RCTRL.NO 181.74,11.56 D52.A
N$98
  Bottom 0.254: D51.A 181.74,30.61 PERIOD.NO
N$99
  Bottom 0.254: L.NO 181.74,49.66 D50.A
N$100
  Bottom 0.254: D49.A 181.74,68.71 O.NO
N$101
  Bottom 0.254: 9.NO 178.82,84.84 D48.A
N$107
  Bottom 0.254: FN.NO 200.79,11.56 D57.A
N$108
  Bottom 0.254: D56.A 200.79,30.61 SLASH.NO
N$109
  Bottom 0.254: COLON.NO 200.79,49.66 D55.A
N$110
  Bottom 0.254: D54.A 200.79,68.71 P.NO
N$111
  Bottom 0.254: D53.A 197.61,87.12 199.39,88.9 0.NO
N$117
  Bottom 0.254: NUM.NO 219.84,11.56 D62.A
N$118
  Bottom 0.254: D61.A 219.84,30.61 RSHIFT.NO
N$119
  Bottom 0.254: QUOTE.NO 219.84,49.66 D60.A
N$120
  Bottom 0.254: D59.A 219.84,68.71 ENTER.NO
N$121
  Top 0.254: D58.A 220.98,88.01 DEL.NO
RESET  (via drill 0.35)
  Top 0.254: U1.9 233.04,37.47 233.04,56.9 234.95,58.8 v234.95,60.96 245.11,60.96 R3.1 | U$2.P$2 234.26,93.3 JP1.RESET
  Bottom 0.254: v234.95,60.96 233.04,60.96 230.5,63.5 230.5,85.14 U$2.P$2
ROW0
  Bottom 0.254: U1.1 234.31,55.24 231.01,55.24 229.87,56.39 229.87,82.93 221.49,91.31 D58.C 199.14,91.31 D53.C 197.23,92.46 D48.C D43.C 158.5,91.44 D38.C 121.54,91.44 D33.C D28.C 84.58,91.57 D23.C D18.C D13.C D8.C D3.C
ROW1
  Top 0.254: D59.C D54.C
  Bottom 0.254: D4.C 16.89,77.22 25.27,77.22 D9.C 27.05,77.22 44.32,77.22 D14.C 46.1,77.22 63.37,77.22 D19.C 65.15,77.22 82.42,77.22 D24.C 84.2,77.22 101.47,77.22 D29.C 103.25,77.22 120.52,77.22 D34.C 122.3,77.22 139.57,77.22 D39.C 141.35,77.22 158.62,77.22 D44.C 160.4,77.22 177.67,77.22 D49.C 179.45,77.22 196.72,77.22 D54.C 198.5,77.22 206.88,77.22 212.72,71.37 212.72,20.95 217.55,16.13 223.01,16.13 227.71,11.43 248.92,11.43 U1.23
ROW2
  Top 0.254: D55.C D60.C
  Bottom 0.254: D5.C D10.C D15.C D20.C D25.C D30.C D35.C D40.C D45.C D50.C D55.C 210.44,57.28 212.09,55.63 212.09,20.7 217.3,15.49 222.76,15.49 227.46,10.79 234.31,10.79 U1.19
ROW3
  Top 0.254: D56.C D61.C
  Bottom 0.254: D6.C D11.C D16.C D21.C D26.C D31.C D36.C D41.C D46.C D51.C D56.C 208.03,38.23 211.46,34.8 211.46,20.45 217.04,14.86 222.5,14.86 228.47,8.89 235.59,8.89 237.49,10.79 249.56,10.79 U1.22
ROW4
  Top 0.254: D57.C D62.C
  Bottom 0.254: D7.C D12.C D17.C D32.C D47.C D52.C D57.C 211.84,19.18 216.79,14.22 222.25,14.22 228.22,8.26 234.31,8.26 U1.20
SCK  (via drill 0.35)
  Top 0.254: v253.37,41.91 253.24,42.04 253.24,90.93 246.38,97.79 243.84,97.79 JP1.SCK
  Bottom 0.254: U1.8 247.65,38.1 248.92,39.37 251.46,39.37 253.24,41.15 253.24,41.78 v253.37,41.91
VCC
  Top 0.406: R3.2 C3.+ | R4.1 232.28,58.29 C1.1 | C3.+ 243.84,76.2 243.84,78.74 245.53,80.42 J1.A4 J1.B9 248.32,80.42 248.92,81.03 248.92,84.07 248.32,84.67 J1.B4 J1.A9 245.53,84.67 243.84,86.36 243.84,95.25 JP1.+5V | C3.+ 247.65,73.66 252.48,68.83 252.48,35.18 253.87,33.78 253.87,31.75 C2.1 U1.30
  Bottom 0.406: R3.2 247.65,68.58 247.65,59.18 246.63,58.17 235.2,58.17 R4.1 | C1.1 234.95,33.66 U1.10

### Text on the board
Bottom: 55%
tPlace: RST | BOOT | JLCJLCJLCJLC